# Altium schematic sheet linear_buffered_sense.SchDoc
size A
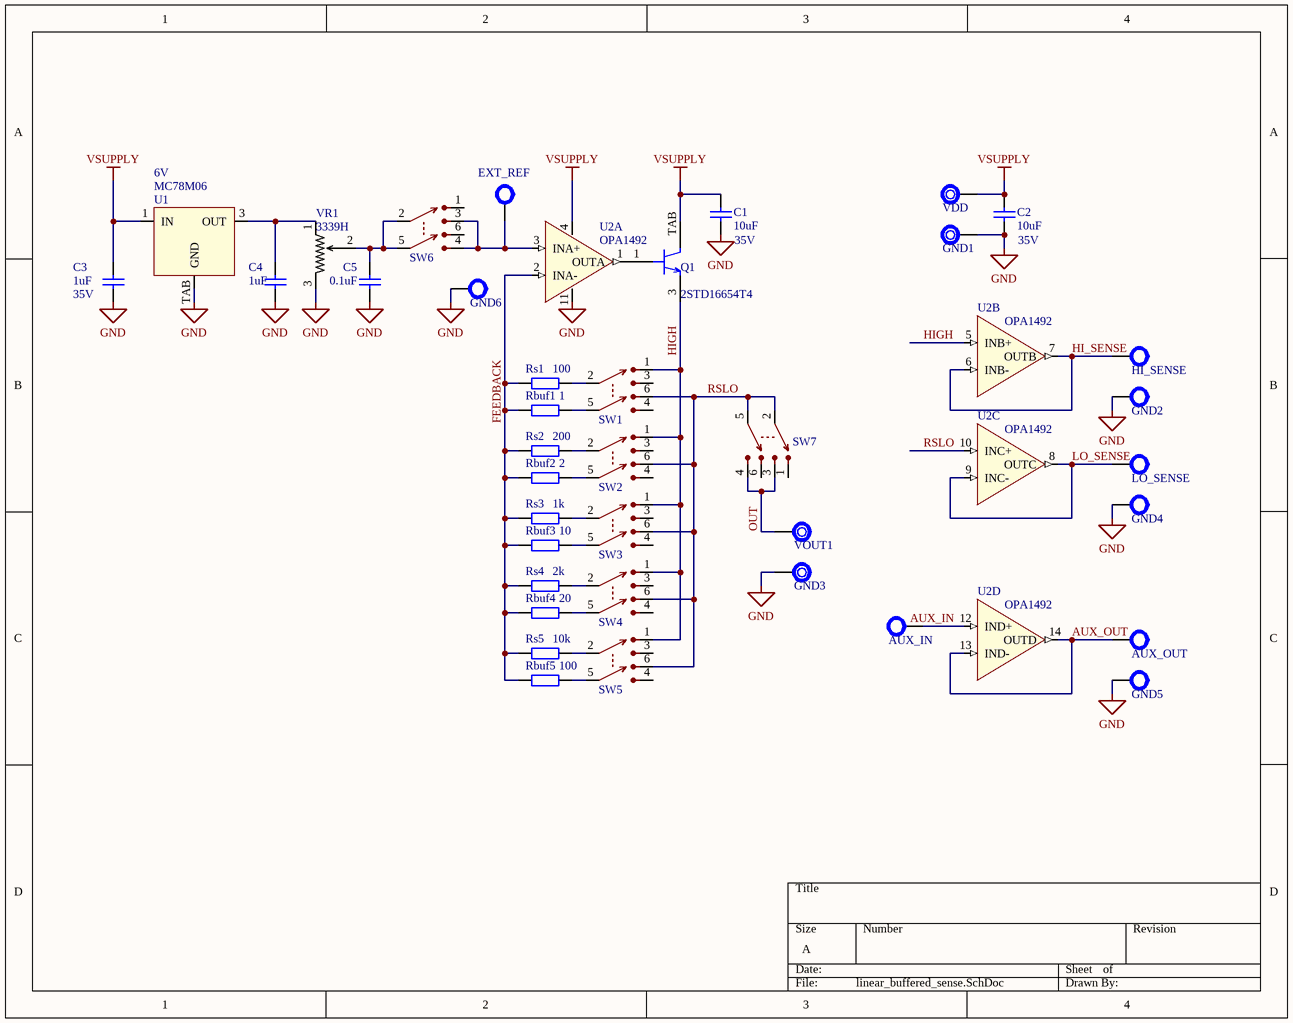
[diagram p0: linear_buffered_sense.SchDoc]

## Parts
AUX_IN  Test Point  [Test Point - Large]  (value not drawn)
AUX_OUT  Test Point  [Test Point - Large]  (value not drawn)
C1  value 10uF  Rating: 35V  [1210-W]  (hidden comment: Cap)
C2  value 10uF  Rating: 35V  [1210-W]  (hidden comment: Cap)
C3  value 1uF  Rating: 35V  [0805]  (hidden comment: Cap)
C4  value 1uF  [0805]  (hidden comment: Cap)
C5  value 0.1uF  [0805]  (hidden comment: Cap)
EXT_REF  Test Point  [Test Point - Large]  (value not drawn)
GND1  BANANA  [BANANA]  (value not drawn)
GND2  Test Point  [Test Point - Large]  (value not drawn)
GND3  BANANA  [BANANA]  (value not drawn)
GND4  Test Point  [Test Point - Large]  (value not drawn)
GND5  Test Point  [Test Point - Large]  (value not drawn)
GND6  Test Point  [Test Point - Large]  (value not drawn)
HI_SENSE  Test Point  [Test Point - Large]  (value not drawn)
LO_SENSE  Test Point  [Test Point - Large]  (value not drawn)
Q1  2STD16654T4  [TO-252]
Rbuf1  value 1  [AXIAL-0.4]  (hidden comment: Res2)
Rbuf2  value 2  [AXIAL-0.4]  (hidden comment: Res2)
Rbuf3  value 10  [AXIAL-0.4]  (hidden comment: Res2)
Rbuf4  value 20  [AXIAL-0.4]  (hidden comment: Res2)
Rbuf5  value 100  [AXIAL-0.4]  (hidden comment: Res2)
Rs1  value 100  [AXIAL-0.4]  (hidden comment: Res2)
Rs2  value 200  [AXIAL-0.4]  (hidden comment: Res2)
Rs3  value 1k  [AXIAL-0.4]  (hidden comment: Res2)
Rs4  value 2k  [AXIAL-0.4]  (hidden comment: Res2)
Rs5  value 10k  [AXIAL-0.4]  (hidden comment: Res2)
SW1  JS202011CQN  [JS202011CQN_LABEL]  (value not drawn)
SW2  JS202011CQN  [JS202011CQN_LABEL]  (value not drawn)
SW3  JS202011CQN  [JS202011CQN_LABEL]  (value not drawn)
SW4  JS202011CQN  [JS202011CQN_LABEL]  (value not drawn)
SW5  JS202011CQN  [JS202011CQN_LABEL]  (value not drawn)
SW6  JS202011CQN  [JS202011CQN]  (value not drawn)
SW7  JS202011CQN  [JS202011CQN]  (value not drawn)
U1  MC78M06  value 6V  [TO-252]
U2  OPA1492  [14-SOIC-TI]  (parts A,B,C,D of 4)
VDD  BANANA  [BANANA]  (value not drawn)
VOUT1  BANANA  [BANANA]  (value not drawn)
VR1  3339H  [3339H]

## Nets
GND: C1.1 C2.1 C3.1 C4.1 C5.1 GND1.0 GND2.0 GND3.0 GND4.0 GND5.0 GND6.0 U1.TAB(GND) U2.11(V-) VR1.3(CW)
VSUPPLY: C1.2 C2.2 C3.2 Q1.TAB(C) U1.1(IN) U2.4(V+) VDD.0
AUX_OUT: AUX_OUT.0 U2.13(IND-) U2.14(OUTD)
FEEDBACK: Rbuf1.2 Rbuf2.2 Rbuf3.2 Rbuf4.2 Rbuf5.2 Rs1.2 Rs2.2 Rs3.2 Rs4.2 Rs5.2 U2.2(INA-)
HI_SENSE: HI_SENSE.0 U2.6(INB-) U2.7(OUTB)
HIGH: Q1.3(E) SW1.1 SW2.1 SW3.1 SW4.1 SW5.1 U2.5(INB+)
LO_SENSE: LO_SENSE.0 U2.8(OUTC) U2.9(INC-)
OUT: SW7.3 SW7.4 VOUT1.0
RSLO: SW1.6 SW2.6 SW3.6 SW4.6 SW5.6 SW7.2 SW7.5 U2.10(INC+)
NetAUX_IN_0: AUX_IN.0 U2.12(IND+)
NetC4_2: C4.2 U1.3(OUT) VR1.1(CCW)
NetC5_2: C5.2 SW6.2 SW6.5 VR1.2(WIPER)
NetEXT_REF_0: EXT_REF.0 SW6.3 SW6.4 U2.3(INA+)
NetQ1_1: Q1.1(B) U2.1(OUTA)
NetRbuf1_1: Rbuf1.1 SW1.5
NetRbuf2_1: Rbuf2.1 SW2.5
NetRbuf3_1: Rbuf3.1 SW3.5
NetRbuf4_1: Rbuf4.1 SW4.5
NetRbuf5_1: Rbuf5.1 SW5.5
NetRs1_1: Rs1.1 SW1.2
NetRs2_1: Rs2.1 SW2.2
NetRs3_1: Rs3.1 SW3.2
NetRs4_1: Rs4.1 SW4.2
NetRs5_1: Rs5.1 SW5.2

Not connected (* = marked no-connect by the designer): SW1 3 4; SW2 3 4; SW3 3 4; SW4 3 4; SW5 3 4; SW6 1 6; SW7 1 6

## Notes on the sheet
- Labels drawn without touching a wire or pin: AUX_IN

## Library data of the parts
AUX_IN AUX_OUT EXT_REF GND2 GND4-GND6 HI_SENSE LO_SENSE = Test Point: Test Point, large or small foot prints; Manufacturer Part Number: Example: 5000, 5013; Manufacturer: Keystone Electronics; Digi-key: Example: 5000K-ND, 5012K-ND; Note: *; Rating: *; Value: *
C1-C5 = Cap: Ceramic Capacitor (Surface Mount); Manufacturer: Generic Ceramic Chip Cap (TBD); Digi-Key Part Number: *; Manufacturer Part Number: *; Note: *
  C4 C5: Rating: *
GND1 GND3 VDD VOUT1 = BANANA: Banana plug; Manufacturer Part Number: Example: 5000, 5013; Manufacturer: Keystone Electronics; Digi-key: Example: 5000K-ND, 5012K-ND; Note: *; Rating: *; Value: *
Q1 = 2STD16654T4: STMicroelectronics NPN BJT High Power; Manufacturer Part Number: BF1101WR,115; Manufacturer: NXP Semiconductors; Digi-Key Part Number: 568-6140-1-ND; Rating: *; Value: *; Note: *
Rbuf1-Rbuf5 Rs1-Rs5 = Res2: Resistor; Published: 8-Jun-2000; LatestRevisionDate: 17-Jul-2002; LatestRevisionNote: Re-released for DXP Platform.; PackageReference: AXIAL-0.4; Publisher: Altium Limited; PackageDescription: Axial Device, Thru-Hole; 2 Leads; 0.4 in Pin Spacing
SW1-SW7 = JS202011CQN: 6-pin DPDT (tied) Slide Switch
U1 = MC78M00: 500mA Positive Voltage Regulator
U2 = OPA1492: OPAx192 Op-Amp Texas Instruments
VR1 = 3339H: Bourns 4-turn Trimpot